# Altium schematic sheet VHCDI.SchDoc
size C; SheetNumber: 1; SheetTotal: 2
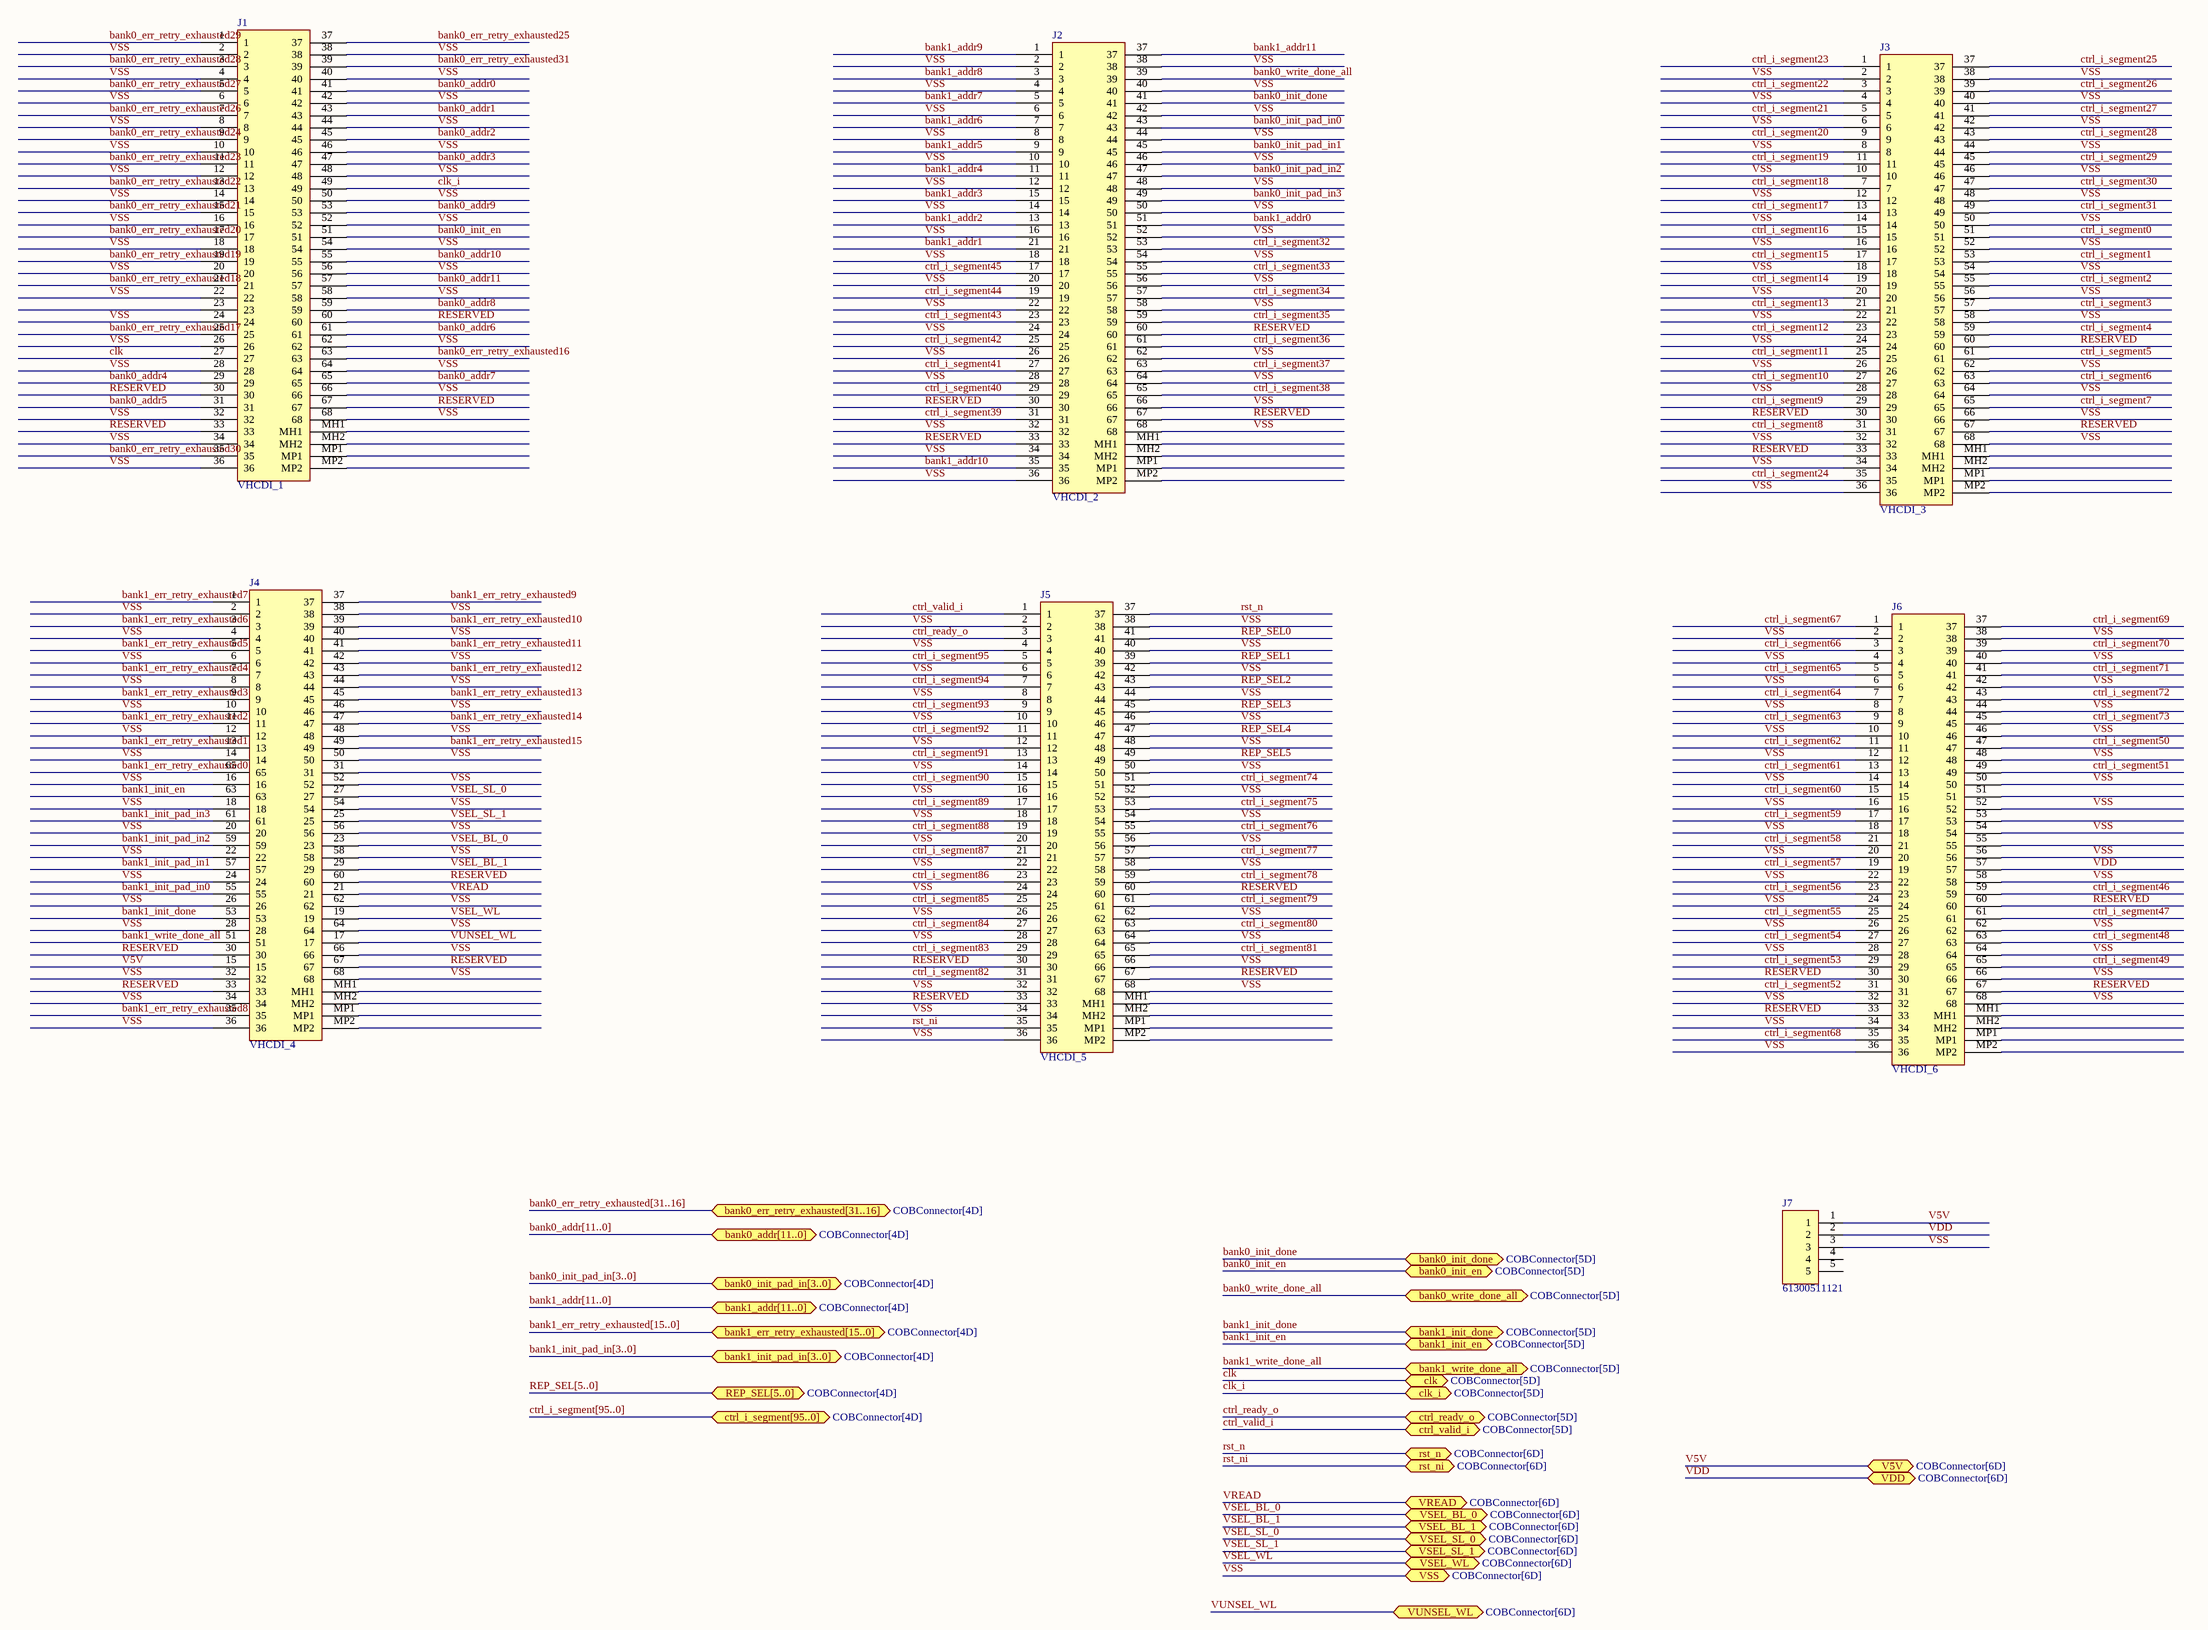
[diagram p0: VHCDI.SchDoc]

## Parts
J1  VHCDI_1  [CONN68_HDRA-EC_HON]
J2  VHCDI_2  [CONN68_HDRA-EC_HON]
J3  VHCDI_3  [CONN68_HDRA-EC_HON]
J4  VHCDI_4  [CONN68_HDRA-EC_HON]
J5  VHCDI_5  [CONN68_HDRA-EC_HON]
J6  VHCDI_6  [CONN68_HDRA-EC_HON]
J7  61300511121  [HDRV5W64P0X254_1X5_1270X254X854P]

## Ports
bank0_addr[11..0] (bidir, see COBConnector[4D]), bank0_err_retry_exhausted[31..16] (bidir, see COBConnector[4D]), bank0_init_done (bidir, see COBConnector[5D]), bank0_init_en (bidir, see COBConnector[5D]), bank0_init_pad_in[3..0] (bidir, see COBConnector[4D]), bank0_write_done_all (bidir, see COBConnector[5D]), bank1_addr[11..0] (bidir, see COBConnector[4D]), bank1_err_retry_exhausted[15..0] (bidir, see COBConnector[4D]), bank1_init_done (bidir, see COBConnector[5D]), bank1_init_en (bidir, see COBConnector[5D]), bank1_init_pad_in[3..0] (bidir, see COBConnector[4D]), bank1_write_done_all (bidir, see COBConnector[5D]), clk (bidir, see COBConnector[5D]), clk_i (bidir, see COBConnector[5D]), ctrl_i_segment[95..0] (bidir, see COBConnector[4D]), ctrl_ready_o (bidir, see COBConnector[5D]), ctrl_valid_i (bidir, see COBConnector[5D]), REP_SEL[5..0] (bidir, see COBConnector[4D]), rst_n (bidir, see COBConnector[6D]), rst_ni (bidir, see COBConnector[6D]), V5V (bidir, see COBConnector[6D]), VDD (bidir, see COBConnector[6D]), VREAD (bidir, see COBConnector[6D]), VSEL_BL_0 (bidir, see COBConnector[6D]), VSEL_BL_1 (bidir, see COBConnector[6D]), VSEL_SL_0 (bidir, see COBConnector[6D]), VSEL_SL_1 (bidir, see COBConnector[6D]), VSEL_WL (bidir, see COBConnector[6D]), VSS (bidir, see COBConnector[6D]), VUNSEL_WL (bidir, see COBConnector[6D])

## Nets
bank0_addr0: J1.41
bank0_addr1: J1.43
bank0_addr2: J1.45
bank0_addr3: J1.47
bank0_addr4: J1.29
bank0_addr5: J1.31
bank0_addr6: J1.61
bank0_addr7: J1.65
bank0_addr8: J1.59
bank0_addr9: J1.53
bank0_addr10: J1.55
bank0_addr11: J1.57
bank0_err_retry_exhausted16: J1.63
bank0_err_retry_exhausted17: J1.25
bank0_err_retry_exhausted18: J1.21
bank0_err_retry_exhausted19: J1.19
bank0_err_retry_exhausted20: J1.17
bank0_err_retry_exhausted21: J1.15
bank0_err_retry_exhausted22: J1.13
bank0_err_retry_exhausted23: J1.11
bank0_err_retry_exhausted24: J1.9
bank0_err_retry_exhausted25: J1.37
bank0_err_retry_exhausted26: J1.7
bank0_err_retry_exhausted27: J1.5
bank0_err_retry_exhausted28: J1.3
bank0_err_retry_exhausted29: J1.1
bank0_err_retry_exhausted30: J1.35
bank0_err_retry_exhausted31: J1.39
bank0_init_done: J2.41 ; port bank0_init_done
bank0_init_en: J1.51 ; port bank0_init_en
bank0_init_pad_in0: J2.43
bank0_init_pad_in1: J2.45
bank0_init_pad_in2: J2.47
bank0_init_pad_in3: J2.49
bank0_write_done_all: J2.39 ; port bank0_write_done_all
bank1_addr0: J2.51
bank1_addr1: J2.21
bank1_addr2: J2.13
bank1_addr3: J2.15
bank1_addr4: J2.11
bank1_addr5: J2.9
bank1_addr6: J2.7
bank1_addr7: J2.5
bank1_addr8: J2.3
bank1_addr9: J2.1
bank1_addr10: J2.35
bank1_addr11: J2.37
bank1_err_retry_exhausted0: J4.65
bank1_err_retry_exhausted1: J4.13
bank1_err_retry_exhausted2: J4.11
bank1_err_retry_exhausted3: J4.9
bank1_err_retry_exhausted4: J4.7
bank1_err_retry_exhausted5: J4.5
bank1_err_retry_exhausted6: J4.3
bank1_err_retry_exhausted7: J4.1
bank1_err_retry_exhausted8: J4.35
bank1_err_retry_exhausted9: J4.37
bank1_err_retry_exhausted10: J4.39
bank1_err_retry_exhausted11: J4.41
bank1_err_retry_exhausted12: J4.43
bank1_err_retry_exhausted13: J4.45
bank1_err_retry_exhausted14: J4.47
bank1_err_retry_exhausted15: J4.49
bank1_init_done: J4.53 ; port bank1_init_done
bank1_init_en: J4.63 ; port bank1_init_en
bank1_init_pad_in0: J4.55
bank1_init_pad_in1: J4.57
bank1_init_pad_in2: J4.59
bank1_init_pad_in3: J4.61
bank1_write_done_all: J4.51 ; port bank1_write_done_all
clk: J1.27 ; port clk
clk_i: J1.49 ; port clk_i
ctrl_i_segment0: J3.51
ctrl_i_segment1: J3.53
ctrl_i_segment2: J3.55
ctrl_i_segment3: J3.57
ctrl_i_segment4: J3.59
ctrl_i_segment5: J3.61
ctrl_i_segment6: J3.63
ctrl_i_segment7: J3.65
ctrl_i_segment8: J3.31
ctrl_i_segment9: J3.29
ctrl_i_segment10: J3.27
ctrl_i_segment11: J3.25
ctrl_i_segment12: J3.23
ctrl_i_segment13: J3.21
ctrl_i_segment14: J3.19
ctrl_i_segment15: J3.17
ctrl_i_segment16: J3.15
ctrl_i_segment17: J3.13
ctrl_i_segment18: J3.7
ctrl_i_segment19: J3.11
ctrl_i_segment20: J3.9
ctrl_i_segment21: J3.5
ctrl_i_segment22: J3.3
ctrl_i_segment23: J3.1
ctrl_i_segment24: J3.35
ctrl_i_segment25: J3.37
ctrl_i_segment26: J3.39
ctrl_i_segment27: J3.41
ctrl_i_segment28: J3.43
ctrl_i_segment29: J3.45
ctrl_i_segment30: J3.47
ctrl_i_segment31: J3.49
ctrl_i_segment32: J2.53
ctrl_i_segment33: J2.55
ctrl_i_segment34: J2.57
ctrl_i_segment35: J2.59
ctrl_i_segment36: J2.61
ctrl_i_segment37: J2.63
ctrl_i_segment38: J2.65
ctrl_i_segment39: J2.31
ctrl_i_segment40: J2.29
ctrl_i_segment41: J2.27
ctrl_i_segment42: J2.25
ctrl_i_segment43: J2.23
ctrl_i_segment44: J2.19
ctrl_i_segment45: J2.17
ctrl_i_segment46: J6.59
ctrl_i_segment47: J6.61
ctrl_i_segment48: J6.63
ctrl_i_segment49: J6.65
ctrl_i_segment50: J6.47
ctrl_i_segment51: J6.49
ctrl_i_segment52: J6.31
ctrl_i_segment53: J6.29
ctrl_i_segment54: J6.27
ctrl_i_segment55: J6.25
ctrl_i_segment56: J6.23
ctrl_i_segment57: J6.19
ctrl_i_segment58: J6.21
ctrl_i_segment59: J6.17
ctrl_i_segment60: J6.15
ctrl_i_segment61: J6.13
ctrl_i_segment62: J6.11
ctrl_i_segment63: J6.9
ctrl_i_segment64: J6.7
ctrl_i_segment65: J6.5
ctrl_i_segment66: J6.3
ctrl_i_segment67: J6.1
ctrl_i_segment68: J6.35
ctrl_i_segment69: J6.37
ctrl_i_segment70: J6.39
ctrl_i_segment71: J6.41
ctrl_i_segment72: J6.43
ctrl_i_segment73: J6.45
ctrl_i_segment74: J5.51
ctrl_i_segment75: J5.53
ctrl_i_segment76: J5.55
ctrl_i_segment77: J5.57
ctrl_i_segment78: J5.59
ctrl_i_segment79: J5.61
ctrl_i_segment80: J5.63
ctrl_i_segment81: J5.65
ctrl_i_segment82: J5.31
ctrl_i_segment83: J5.29
ctrl_i_segment84: J5.27
ctrl_i_segment85: J5.25
ctrl_i_segment86: J5.23
ctrl_i_segment87: J5.21
ctrl_i_segment88: J5.19
ctrl_i_segment89: J5.17
ctrl_i_segment90: J5.15
ctrl_i_segment91: J5.13
ctrl_i_segment92: J5.11
ctrl_i_segment93: J5.9
ctrl_i_segment94: J5.7
ctrl_i_segment95: J5.5
ctrl_ready_o: J5.3 ; port ctrl_ready_o
ctrl_valid_i: J5.1 ; port ctrl_valid_i
REP_SEL0: J5.41
REP_SEL1: J5.39
REP_SEL2: J5.43
REP_SEL3: J5.45
REP_SEL4: J5.47
REP_SEL5: J5.49
RESERVED: J1.30 J1.33 J1.60 J1.67 J2.30 J2.33 J2.60 J2.67 J3.30 J3.33 J3.60 J3.67 J4.30 J4.33 J4.60 J4.67 J5.30 J5.33 J5.60 J5.67 J6.30 J6.33 J6.60 J6.67
rst_n: J5.37 ; port rst_n
rst_ni: J5.35 ; port rst_ni
V5V: J4.15 J7.1 ; port V5V
VDD: J6.57 J7.2 ; port VDD
VREAD: J4.21 ; port VREAD
VSEL_BL_0: J4.23 ; port VSEL_BL_0
VSEL_BL_1: J4.29 ; port VSEL_BL_1
VSEL_SL_0: J4.27 ; port VSEL_SL_0
VSEL_SL_1: J4.25 ; port VSEL_SL_1
VSEL_WL: J4.19 ; port VSEL_WL
VSS: J1.2 J1.4 J1.6 J1.8 J1.10 J1.12 J1.14 J1.16 J1.18 J1.20 J1.22 J1.24 J1.26 J1.28 J1.32 J1.34 J1.36 J1.38 J1.40 J1.42 J1.44 J1.46 J1.48 J1.50 J1.52 J1.54 J1.56 J1.58 J1.62 J1.64 J1.66 J1.68 J2.2 J2.4 J2.6 J2.8 J2.10 J2.12 J2.14 J2.16 J2.18 J2.20 J2.22 J2.24 J2.26 J2.28 J2.32 J2.34 J2.36 J2.38 J2.40 J2.42 J2.44 J2.46 J2.48 J2.50 J2.52 J2.54 J2.56 J2.58 J2.62 J2.64 J2.66 J2.68 J3.2 J3.4 J3.6 J3.8 J3.10 J3.12 J3.14 J3.16 J3.18 J3.20 J3.22 J3.24 J3.26 J3.28 J3.32 J3.34 J3.36 J3.38 J3.40 J3.42 J3.44 J3.46 J3.48 J3.50 J3.52 J3.54 J3.56 J3.58 J3.62 J3.64 J3.66 J3.68 J4.2 J4.4 J4.6 J4.8 J4.10 J4.12 J4.14 J4.16 J4.18 J4.20 J4.22 J4.24 J4.26 J4.28 J4.32 J4.34 J4.36 J4.38 J4.40 J4.42 J4.44 J4.46 J4.48 J4.50 J4.52 J4.54 J4.56 J4.58 J4.62 J4.64 J4.66 J4.68 J5.2 J5.4 J5.6 J5.8 J5.10 J5.12 J5.14 J5.16 J5.18 J5.20 J5.22 J5.24 J5.26 J5.28 J5.32 J5.34 J5.36 J5.38 J5.40 J5.42 J5.44 J5.46 J5.48 J5.50 J5.52 J5.54 J5.56 J5.58 J5.62 J5.64 J5.66 J5.68 J6.2 J6.4 J6.6 J6.8 J6.10 J6.12 J6.14 J6.16 J6.18 J6.20 J6.22 J6.24 J6.26 J6.28 J6.32 J6.34 J6.36 J6.38 J6.40 J6.42 J6.44 J6.46 J6.48 J6.50 J6.52 J6.54 J6.56 J6.58 J6.62 J6.64 J6.66 J6.68 J7.3 ; port VSS
VUNSEL_WL: J4.17 ; port VUNSEL_WL

Not connected (* = marked no-connect by the designer): J1 23 MH1 MH2 MP1 MP2; J2 MH1 MH2 MP1 MP2; J3 MH1 MH2 MP1 MP2; J4 31 MH1 MH2 MP1 MP2; J5 MH1 MH2 MP1 MP2; J6 51 53 55 MH1 MH2 MP1 MP2; J7 4 5

## Buses and harness runs
bus bank0_addr[11..0] = port bank0_addr[11..0]
bus bank0_err_retry_exhausted[31..16] = port bank0_err_retry_exhausted[31..16]
bus bank0_init_pad_in[3..0] = port bank0_init_pad_in[3..0]
bus bank1_addr[11..0] = port bank1_addr[11..0]
bus bank1_err_retry_exhausted[15..0] = port bank1_err_retry_exhausted[15..0]
bus bank1_init_pad_in[3..0] = port bank1_init_pad_in[3..0]
bus ctrl_i_segment[95..0] = port ctrl_i_segment[95..0]
bus REP_SEL[5..0] = port REP_SEL[5..0]

## Library data of the parts
J1-J6 = 785633-01: Connector; Manufacturer_Name: NI; Datasheet Link: https://www.digikey.com/en/products/detail/ni/785633-01/16637125?s=N4IgTCBcDaIOwA4CsA2AzGkBdAvkA; Height: 10.8mm; Manufacturer_Part_Number: 785633-01
J7 = 61300511121: Connector; Manufacturer_Name: Wurth Elektronik; Datasheet Link: http://katalog.we-online.de/em/datasheet/6130xx11121.pdf; Height: 8.54mm; Manufacturer_Part_Number: 61300511121; Mouser Part Number: 710-61300511121; Mouser Price/Stock: https://www.mouser.co.uk/ProductDetail/Wurth-Elektronik/61300511121?qs=PhR8RmCirEZCsCRHq%252BvfRQ%3D%3D